# EAGLE design payload-externalPCB-version2-modif2 (EAGLE 6.5.0)
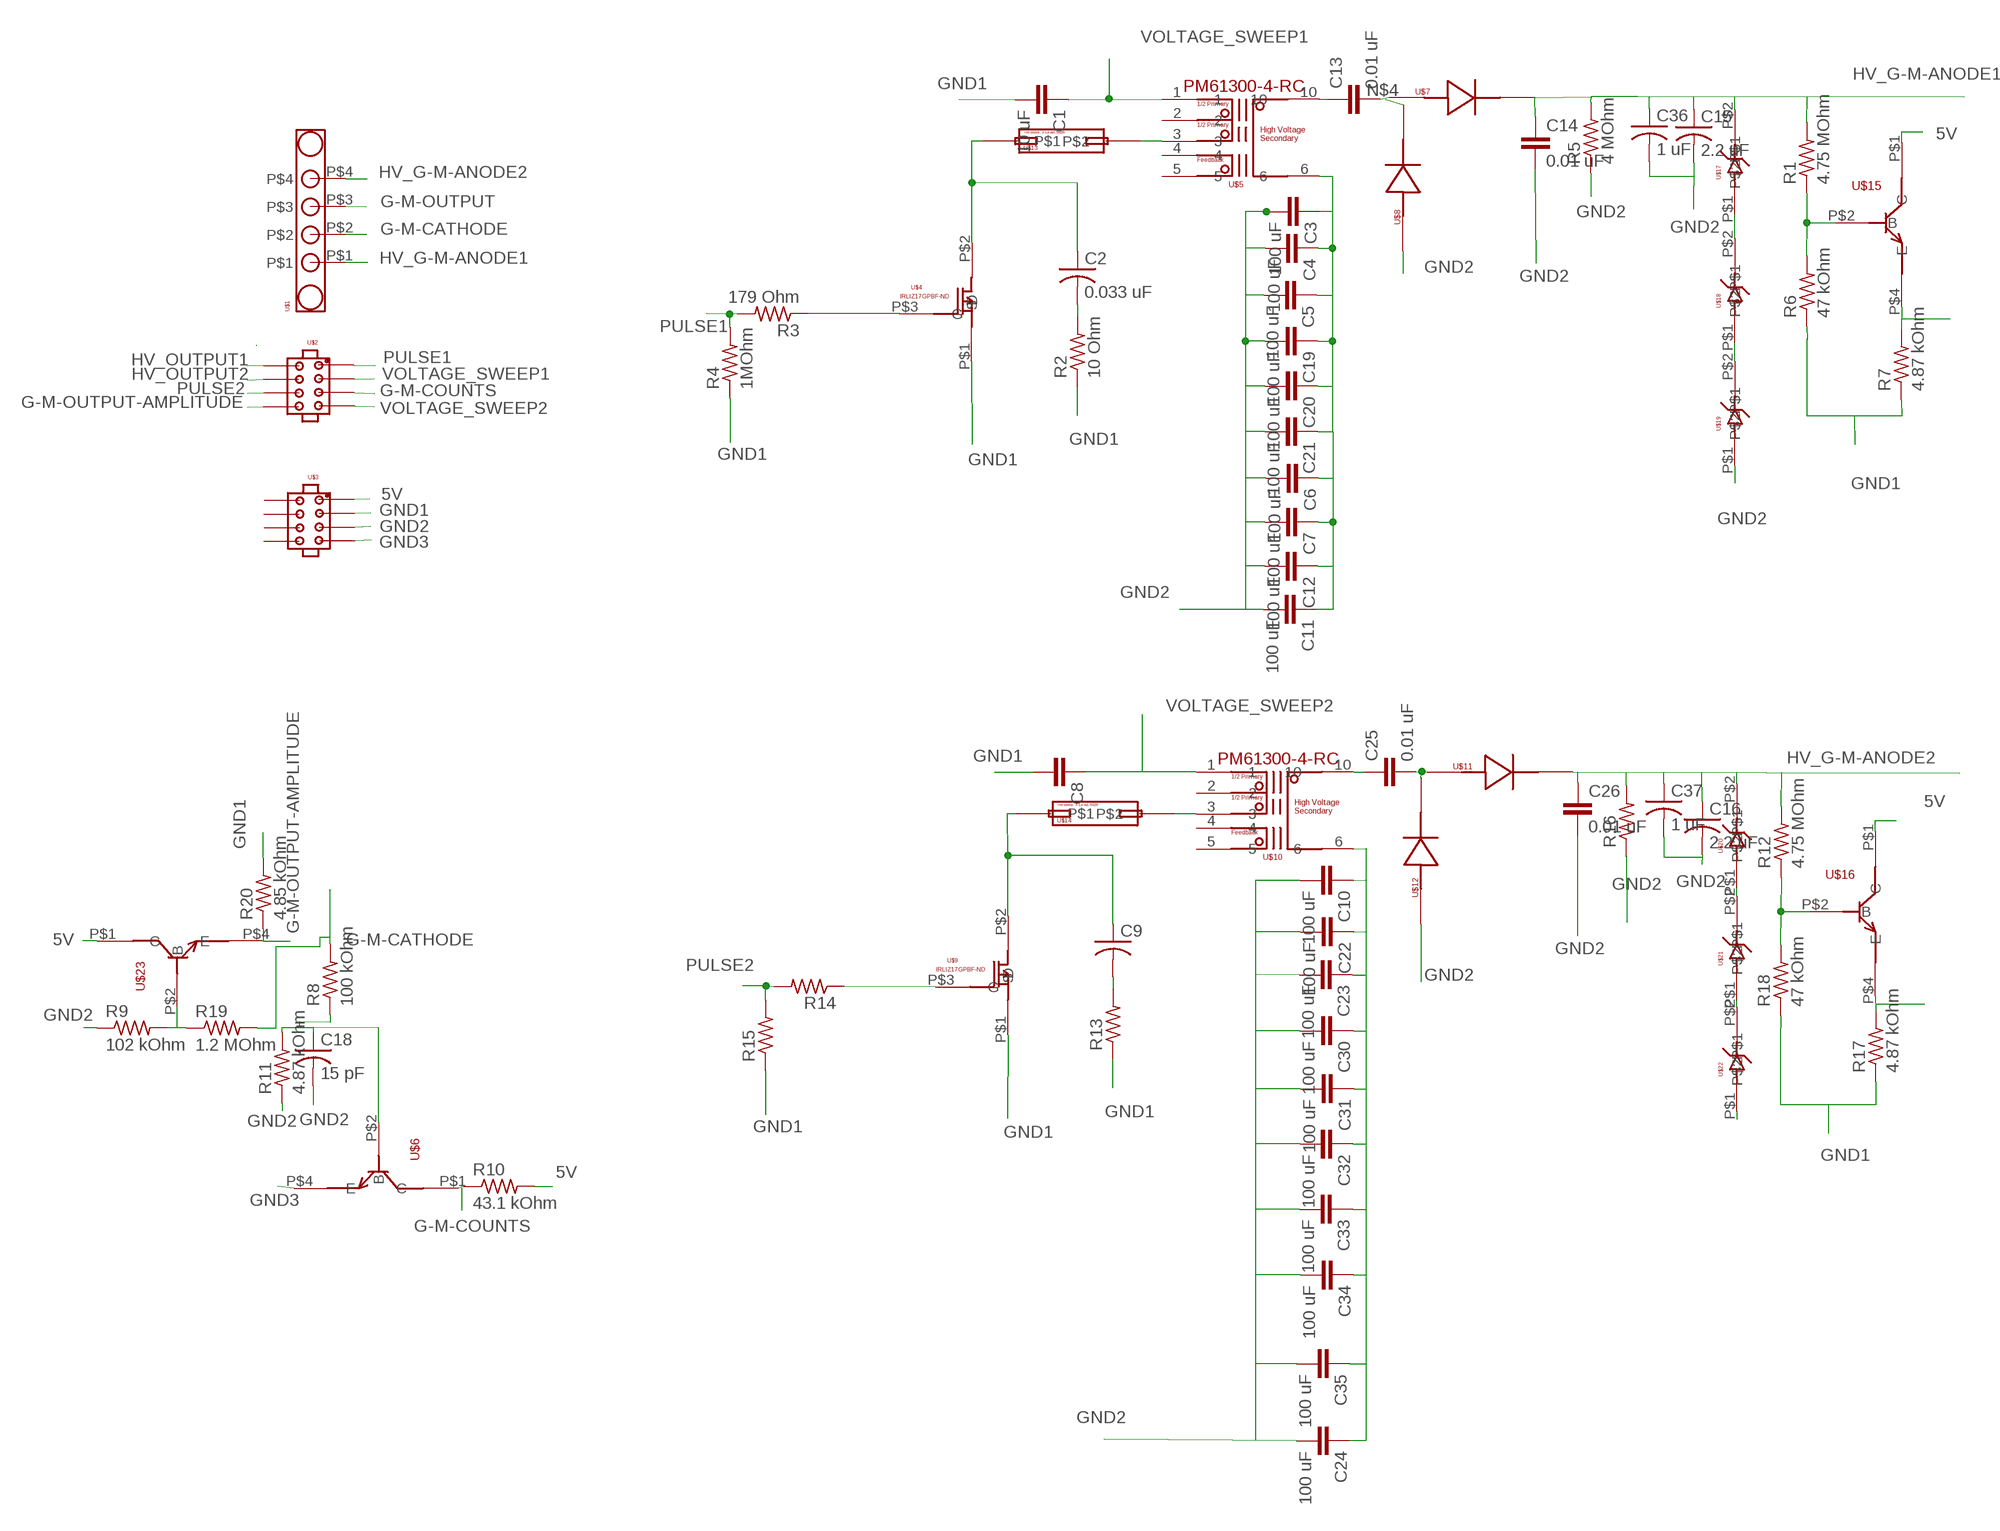
[diagram p0: schematic, sheet 1]

## Parts
C1  10 uF  C-EUC1210  [C1210]
C2  0.033 uF  C-USC0805  [C0805]
C3  100 uF  C-EUC1210  [C1210]
C4  100 uF  C-EUC1210  [C1210]
C5  100 uF  C-EUC1210  [C1210]
C6  100 uF  C-EUC1210  [C1210]
C7  100 uF  C-EUC1210  [C1210]
C8  C-EUC1210  [C1210]
C9  C-USC0805  [C0805]
C10  100 uF  C-EUC1210  [C1210]
C11  100 uF  C-EUC1210  [C1210]
C12  100 uF  C-EUC1210  [C1210]
C13  0.01 uF  C-EUC1206  [C1206]
C14  0.01 uF  C-EUC1206  [C1206]
C15  2.2 uF  C-USC2220K  [C2220K]
C16  2.2 uF  C-USC2220K  [C2220K]
C18  15 pF  C-USC0805  [C0805]
C19  100 uF  C-EUC1210  [C1210]
C20  100 uF  C-EUC1210  [C1210]
C21  100 uF  C-EUC1210  [C1210]
C22  100 uF  C-EUC1210  [C1210]
C23  100 uF  C-EUC1210  [C1210]
C24  100 uF  C-EUC1210  [C1210]
C25  0.01 uF  C-EUC1206  [C1206]
C26  0.01 uF  C-EUC1206  [C1206]
C30  100 uF  C-EUC1210  [C1210]
C31  100 uF  C-EUC1210  [C1210]
C32  100 uF  C-EUC1210  [C1210]
C33  100 uF  C-EUC1210  [C1210]
C34  100 uF  C-EUC1210  [C1210]
C35  100 uF  C-EUC1210  [C1210]
C36  1 uF  C-USC2220K  [C2220K]
C37  1 uF  C-USC2220K  [C2220K]
R1  4.75 MOhm  R-US_R1206  [R1206]
R2  10 Ohm  R-US_R2010  [R2010]
R3  179 Ohm  R-US_R2010  [R2010]
R4  1MOhm  R-US_R2010  [R2010]
R5  4 MOhm  R-US_R2010  [R2010]
R6  47 kOhm  R-US_R1210  [R1210]
R7  4.87 kOhm  R-US_R2010  [R2010]
R8  100 kOhm  R-US_R2010  [R2010]
R9  102 kOhm  R-US_R1206  [R1206]
R10  43.1 kOhm  R-US_R2010  [R2010]
R11  4.87 kOhm  R-US_R1210  [R1210]
R12  4.75 MOhm  R-US_R1206  [R1206]
R13  R-US_R2010  [R2010]
R14  R-US_R2010  [R2010]
R15  R-US_R2010  [R2010]
R16  R-US_R2010  [R2010]
R17  4.87 kOhm  R-US_R2010  [R2010]
R18  47 kOhm  R-US_R1210  [R1210]
R19  1.2 MOhm  R-US_R1206  [R1206]
R20  4.85 kOhm  R-US_R2010  [R2010]
U$1  M80-5000000M2-04-331-00-000  [M80-5000000M2-04-331-00-000]
U$2  M80-8670805  [M80-8670805]
U$3  M80-8670805  [M80-8670805]
U$4  IRLIZ14GPBF-ND-SCHEMATICS  [TO-220FULLPAK-IRLIZ14GPBF-ND]
U$5  PM61300-4-RC  [PM61300-4-RC]
U$6  PZT3904-SOT223-SCHEMATICS  [SOT223-PZT3904]
U$7  S1J-SCHEMATICS  [DO-214AC-S1J]
U$8  S1J-SCHEMATICS  [DO-214AC-S1J]
U$9  IRLIZ14GPBF-ND-SCHEMATICS  [TO-220FULLPAK-IRLIZ14GPBF-ND]
U$10  PM61300-4-RC  [PM61300-4-RC]
U$11  S1J-SCHEMATICS  [DO-214AC-S1J]
U$12  S1J-SCHEMATICS  [DO-214AC-S1J]
U$13  RESISTOR-J-LEAD-5W  [PACKAGE-13573-J-LEAD]
U$14  RESISTOR-J-LEAD-5W  [PACKAGE-13573-J-LEAD]
U$15  PZT3904-SOT223-SCHEMATICS  [SOT223-PZT3904]
U$16  PZT3904-SOT223-SCHEMATICS  [SOT223-PZT3904]
U$17  SMBJ5388B-ZENER-DIODE-200V  [DO-214AA-SMBJ5388B-ZENER]
U$18  SMBJ5388B-ZENER-DIODE-200V  [DO-214AA-SMBJ5388B-ZENER]
U$19  SMBJ5388B-ZENER-DIODE-200V  [DO-214AA-SMBJ5388B-ZENER]
U$20  SMBJ5388B-ZENER-DIODE-200V  [DO-214AA-SMBJ5388B-ZENER]
U$21  SMBJ5388B-ZENER-DIODE-200V  [DO-214AA-SMBJ5388B-ZENER]
U$22  SMBJ5388B-ZENER-DIODE-200V  [DO-214AA-SMBJ5388B-ZENER]
U$23  PZT3904-SOT223-SCHEMATICS  [SOT223-PZT3904]

## Nets
5V: R10.2 U$3.P$1 U$15.P$1(C) U$16.P$1(C) U$23.P$1(C)
G-M-CATHODE: R8.2 R19.2 U$1.P$2
G-M-COUNTS: R10.1 U$2.P$3 U$6.P$1(C)
G-M-OUTPUT: U$1.P$3
G-M-OUTPUT-AMPLITUDE: R20.1 U$2.P$8 U$23.P$4(E)
GND1: C1.2 C8.2 R2.1 R4.1 R6.1 R7.1 R13.1 R15.1 R17.1 R18.1 R20.2 U$3.P$2 U$4.P$1(S) U$9.P$1(S)
GND2: C3.2 C4.2 C5.2 C6.2 C7.2 C10.2 C11.2 C12.2 C14.2 C15.2 C16.2 C18.2 C19.2 C20.2 C21.2 C22.2 C23.2 C24.2 C26.2 C30.2 C31.2 C32.2 C33.2 C34.2 C35.2 C36.2 C37.2 R5.1 R9.1 R11.1 R16.1 U$3.P$3 U$8.P$1(A) U$12.P$1(A) U$19.P$1 U$22.P$1
GND3: U$3.P$4 U$6.P$4(E)
HV_G-M-ANODE1: C14.1 C15.1 C36.1 R1.2 R5.2 U$1.P$1 U$7.P$2(C) U$17.P$2
HV_G-M-ANODE2: C16.1 C26.1 C37.1 R12.2 R16.2 U$1.P$4 U$11.P$2(C) U$20.P$2
HV_OUTPUT1: R7.2 U$2.P$5 U$15.P$4(E)
HV_OUTPUT2: R17.2 U$2.P$6 U$16.P$4(E)
N$1: R3.1 U$4.P$3(G)
N$2: U$17.P$1 U$18.P$2
N$3: C13.1 U$5.10
N$4: C13.2 U$7.P$1(A) U$8.P$2(C)
N$5: R12.1 R18.2 U$16.P$2(B)
N$6: C3.1 C4.1 C5.1 C6.1 C7.1 C11.1 C12.1 C19.1 C20.1 C21.1 U$5.6
N$7: U$5.3 U$13.P$2
N$8: C2.2 R2.2
N$9: C10.1 C22.1 C23.1 C24.1 C30.1 C31.1 C32.1 C33.1 C34.1 C35.1 U$10.6
N$11: C2.1 U$4.P$2(D) U$13.P$1
N$23: R14.1 U$9.P$3(G)
N$24: C9.2 R13.2
N$25: U$10.3 U$14.P$2
N$26: C9.1 U$9.P$2(D) U$14.P$1
N$27: R1.1 R6.2 U$15.P$2(B)
N$28: C25.1 U$10.10
N$41: C25.2 U$11.P$1(A) U$12.P$2(C)
N$42: U$18.P$1 U$19.P$2
N$43: U$20.P$1 U$21.P$2
N$45: U$21.P$1 U$22.P$2
N$46: C18.1 R8.1 R11.2 U$6.P$2(B)
N$47: R9.2 R19.1 U$23.P$2(B)
PULSE1: R3.2 R4.2 U$2.P$1
PULSE2: R14.2 R15.2 U$2.P$7
VOLTAGE_SWEEP1: C1.1 U$2.P$2 U$5.1
VOLTAGE_SWEEP2: C8.1 U$2.P$4 U$10.1
Unconnected: U$3.P$5 U$3.P$6 U$3.P$7 U$3.P$8 U$5.2 U$5.4 U$5.5 U$10.2 U$10.4 U$10.5

## Library data of the parts
C1 C3-C8 C10-C14 C19-C26 C30-C35 = rcl:C-EU: CAPACITOR, European symbol
C2 C9 C15 C16 C18 C36 C37 = rcl:C-US: CAPACITOR, American symbol
R1-R20 = rcl:R-US_: RESISTOR, American symbol
U$1 = Payload-board:M80-5000000M2-04-331-00-000
U$2 U$3 = Payload-board:M80-8670805
U$4 U$9 = Payload-board:IRLIZ14GPBF-ND-SCHEMATICS
U$5 U$10 = Payload-board:PM61300-4-RC
U$6 U$15 U$16 U$23 = Payload-board:PZT3904-SOT223-SCHEMATICS
U$7 U$8 U$11 U$12 = Payload-board:S1J-SCHEMATICS
U$13 U$14 = Payload-board:RESISTOR-J-LEAD-5W
U$17-U$22 = Payload-board:SMBJ5388B-ZENER-DIODE-200V

## Board
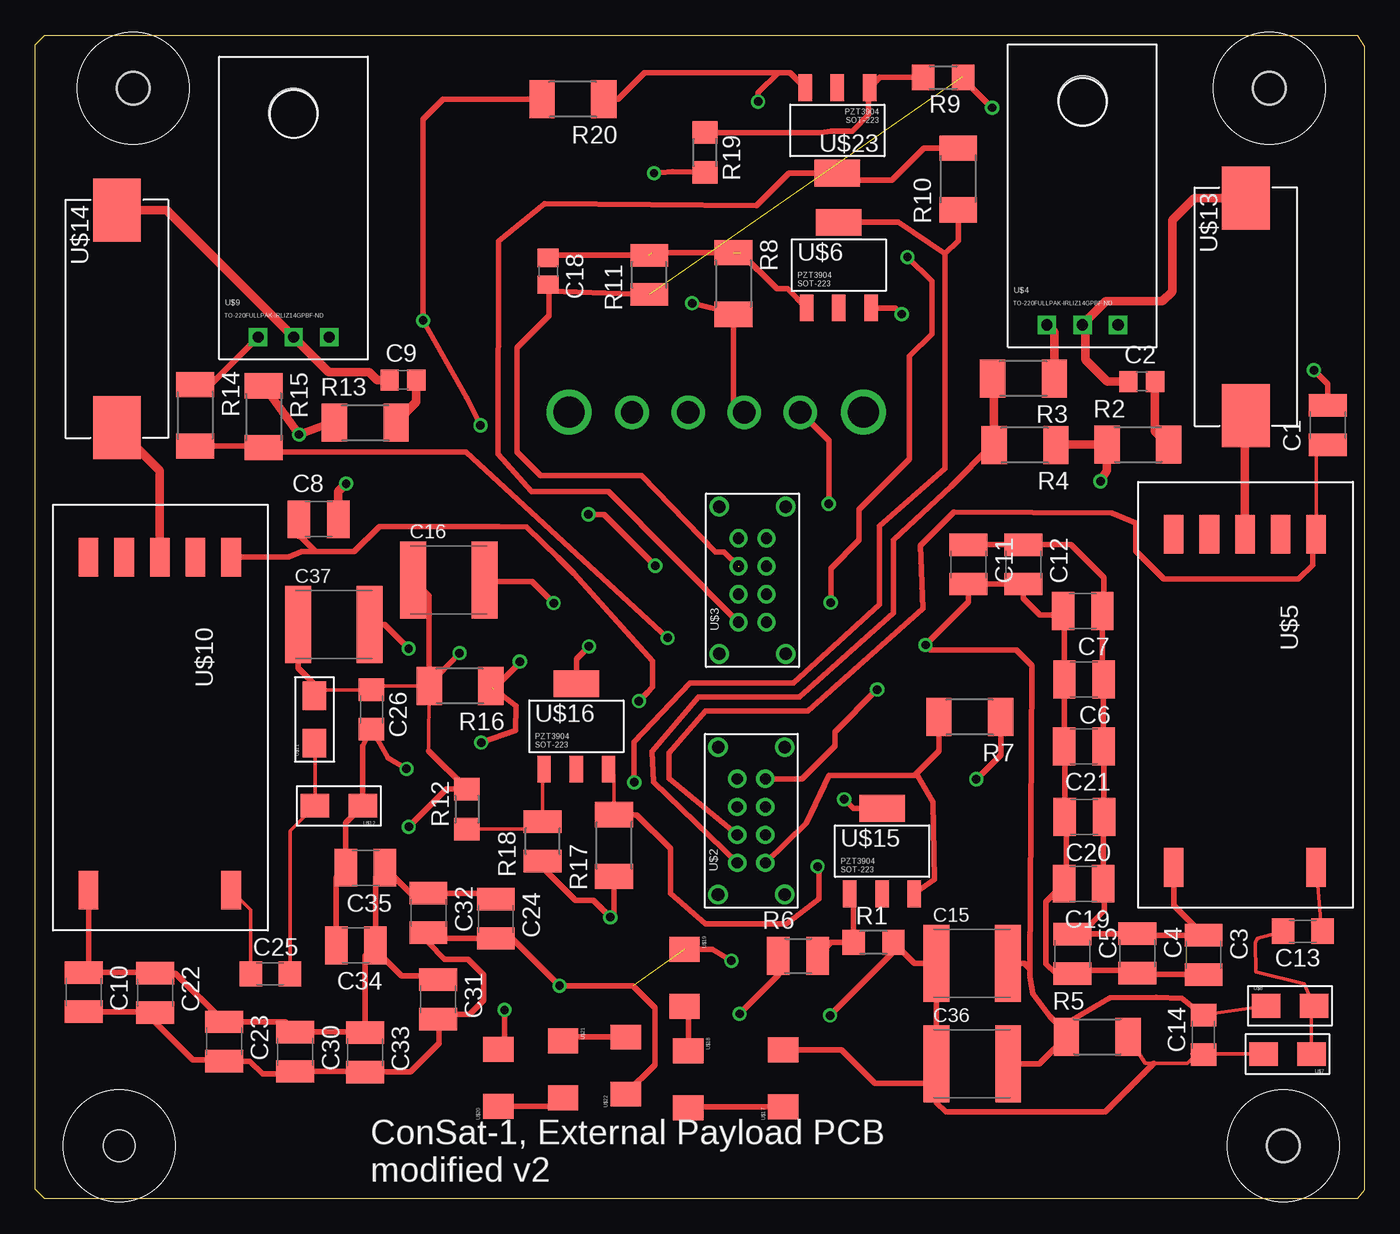
[diagram p1: board, top side]
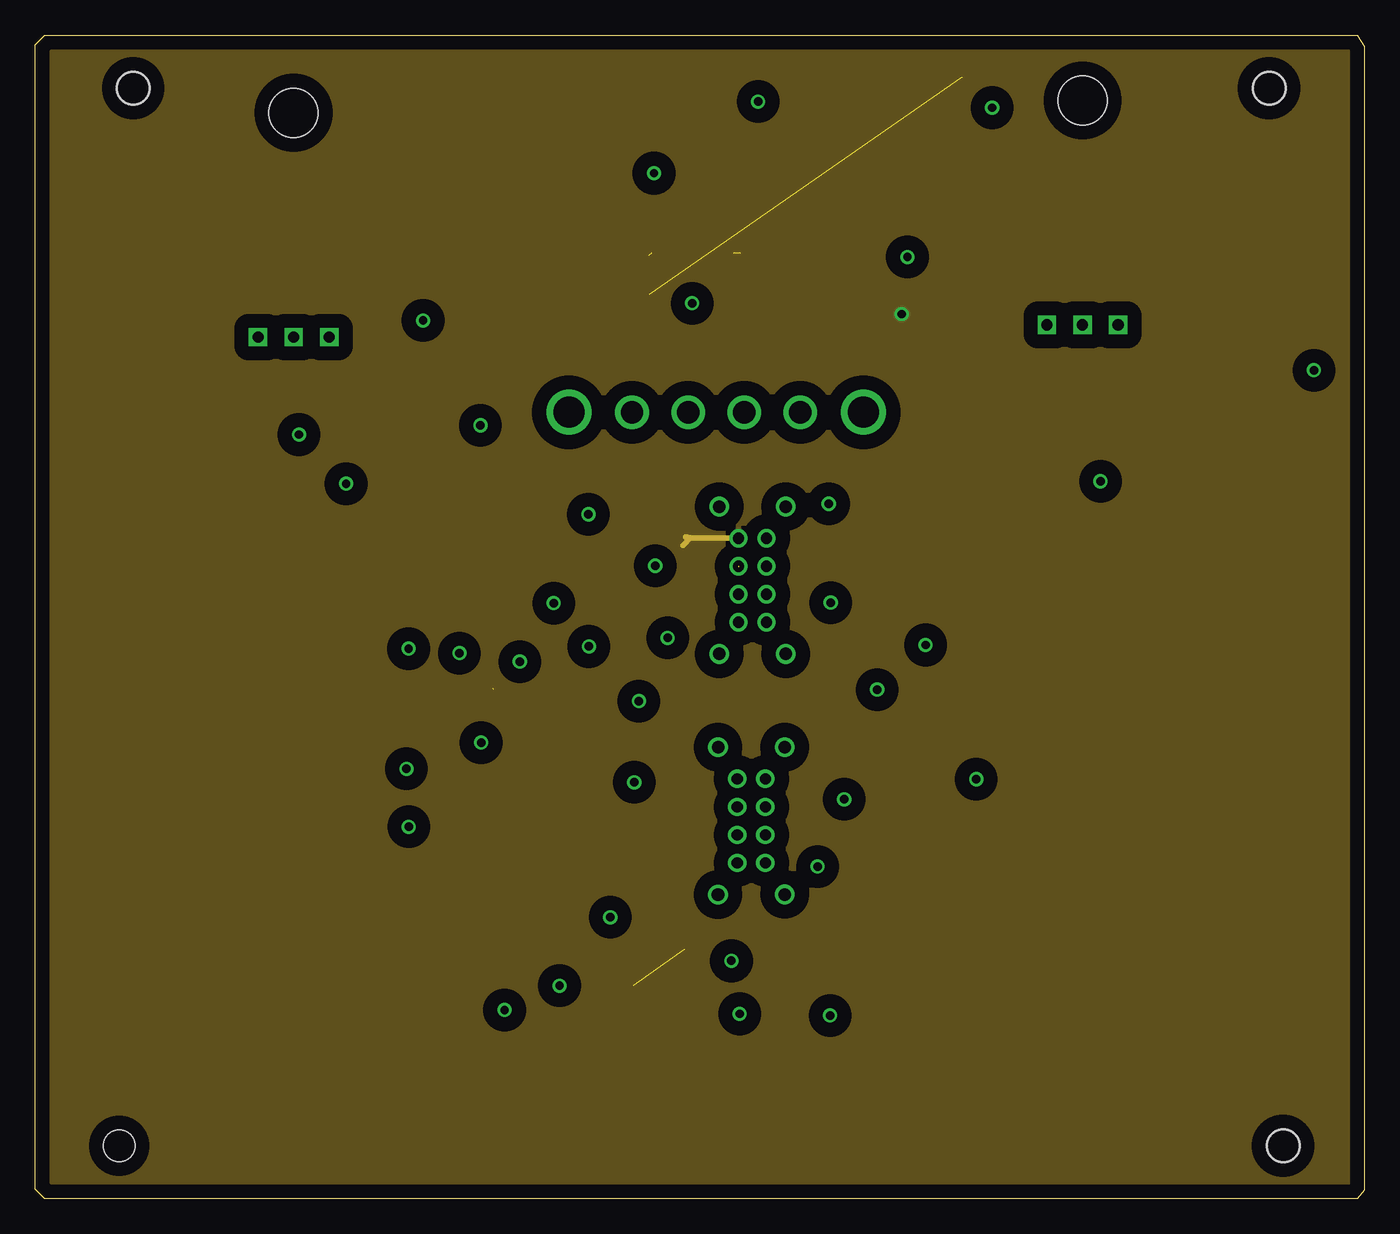
[diagram p2: board, inner layer Layer2]
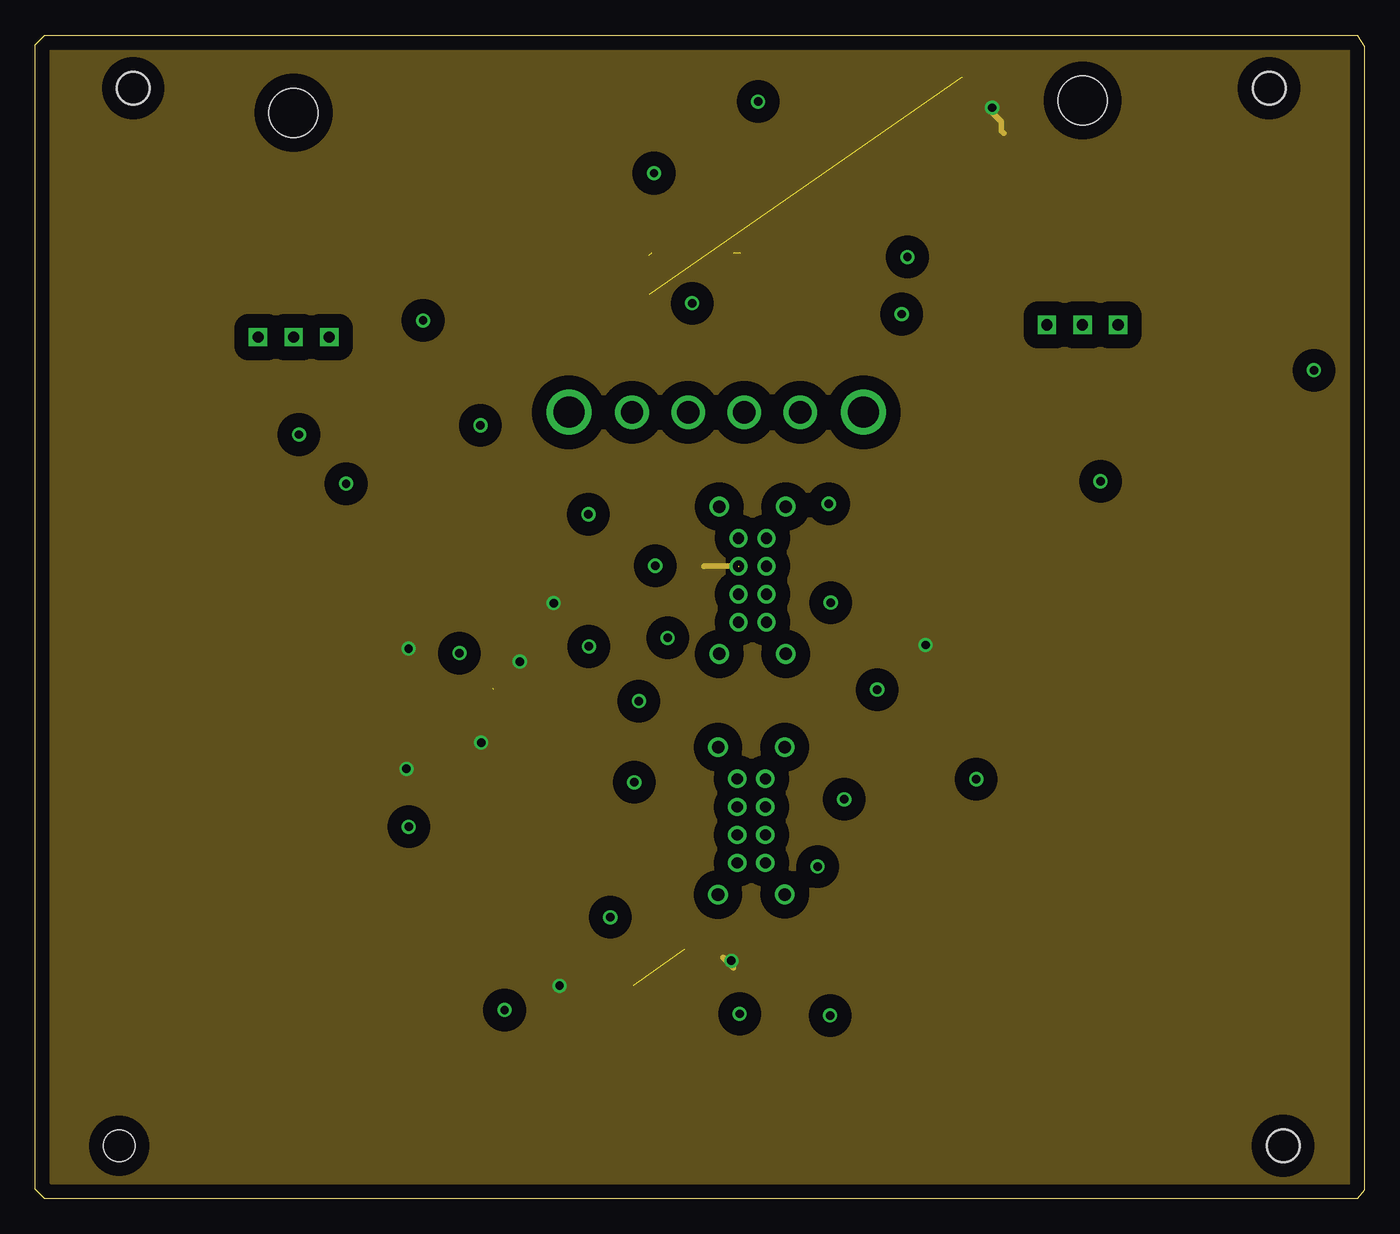
[diagram p3: board, inner layer Layer3]
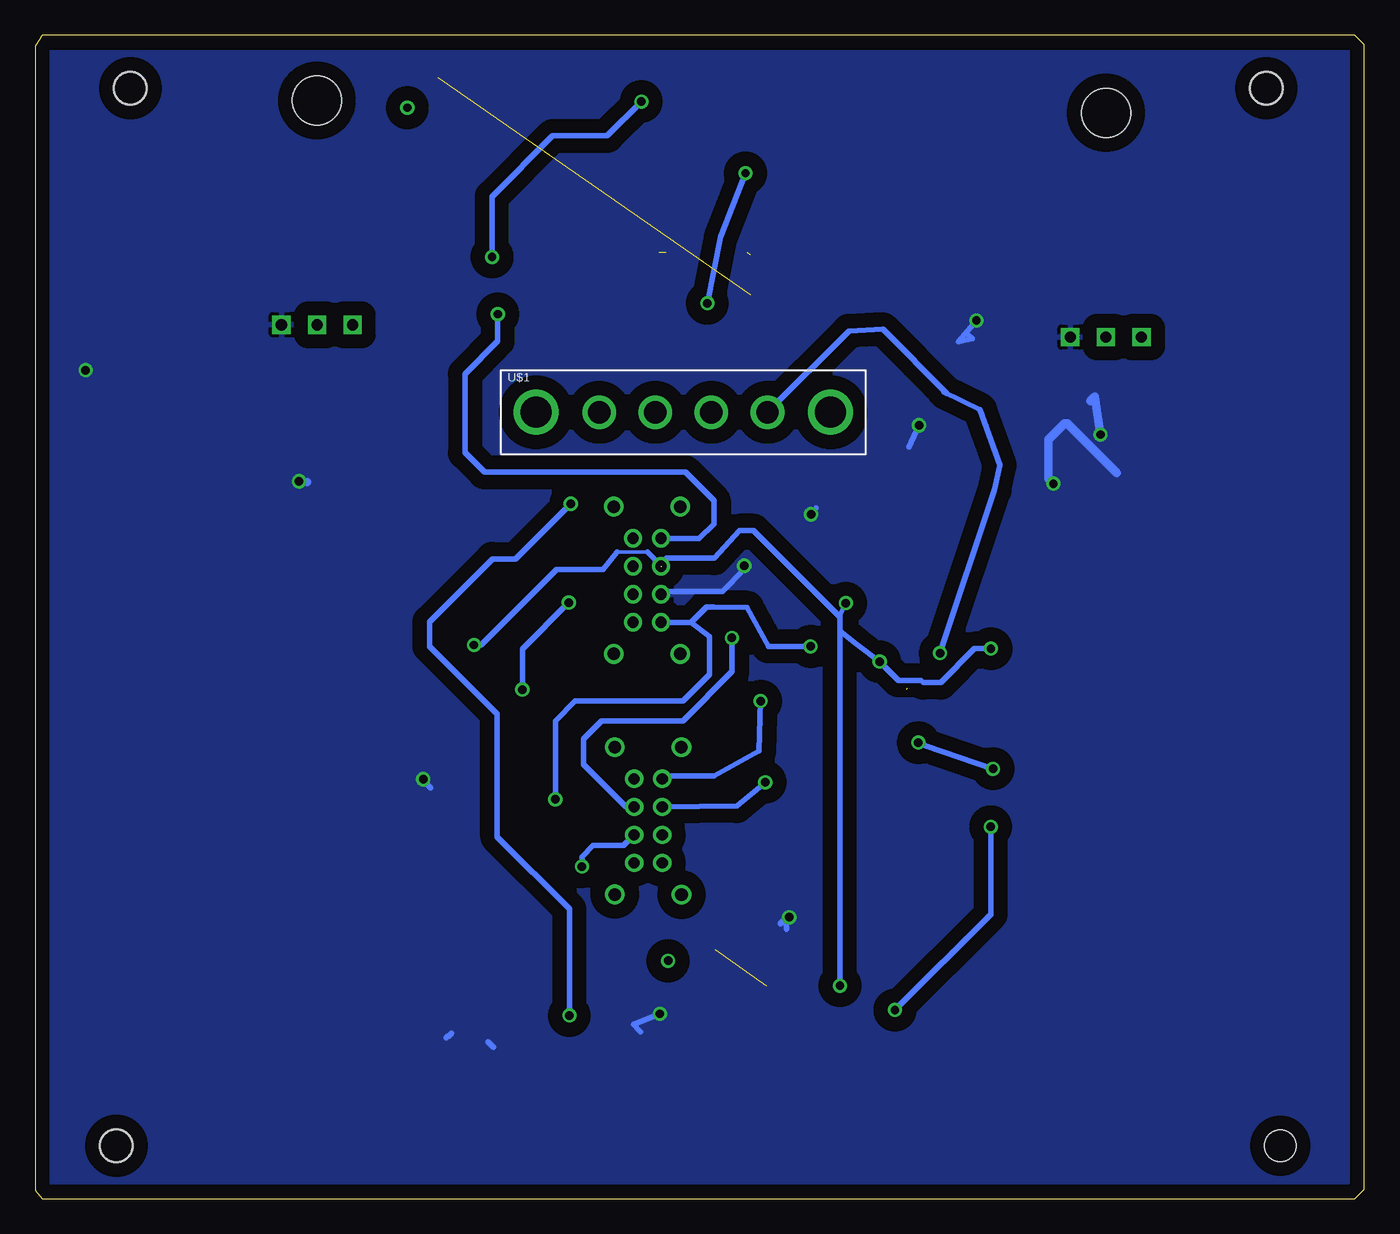
[diagram p4: board, bottom side, seen from below]

Size 94.8 x 83 mm. Coordinates in mm from the lower left corner, seen from the top.
Outline: 94.3,83 94.8,82.2 94.8,0.6 94.3,0 0.7,0 0,0.7 0,82.3 0.7,83 94.3,83
Copper layers (1*2*15*16): Top 0.035mm / dielectric 1.5mm / Layer2 0.035mm / dielectric 0.15mm / Layer3 0.035mm / dielectric 0.2mm / Bottom 0.035mm
Design rules "default *": minimum track width 10mil, minimum drill 24mil, track to track 40mil, track to pad 40mil, pad to pad 10mil, via to via 8mil, smd to smd 8mil, copper to edge 40mil, drill to drill 8mil, minimum pad ring 10mil, minimum via ring 8mil, stop-mask expansion 4mil, vias tented up to drill 0mil, thermal gap 10mil
Holes 2.4 mm at 7,79.2 88,79.2 89,3.8
Holes 2.25 mm at 6,3.8 89,3.8 88,79.2 7,79.2 6,3.8

### Footprints (pad centres in the part's own frame; a part is rotated, then mirrored left to right if it is on the bottom)
C1210 = smd 1.6 x 2.7: 1 -1.4,0; 2 1.4,0
C0805 = smd 1.3 x 1.5: 1 -0.95,0; 2 0.95,0
C1206 = smd 1.6 x 1.8: 1 -1.4,0; 2 1.4,0
C2220K = smd 1.85 x 5.5: 1 -2.55,0; 2 2.55,0
R1206 = smd 1.6 x 1.803: 1 -1.422,0; 2 1.422,0
R2010 = smd 1.8 x 2.7: 1 -2.2,0; 2 2.2,0
R1210 = smd 1.6 x 2.7: 1 -1.4,0; 2 1.4,0
M80-5000000M2-04-331-00-000 = drill 1.6: P$1 -6,0; P$2 -2,0; P$3 2,0; P$4 6,0 | drill 2.2: P$5 -10.5,0; P$6 10.5,0
M80-8670805 = drill 0.8: P$1 -3,1; P$2 -1,1; P$3 1,1; P$4 3,1; P$5 -3,-1; P$6 -1,-1; P$7 1,-1; P$8 3,-1 | drill 0.9: P$9 -5.252,2.378; P$10 -5.25,-2.373; P$11 5.251,-2.376; P$12 5.249,2.374
TO-220FULLPAK-IRLIZ14GPBF-ND = drill 0.8 pad 1.09 square: P$1 2.54,0; P$2 0,0; P$3 -2.54,0 | hole 3.5: 0,16
PM61300-4-RC = smd 2.75 x 1.4: 1 -5,5.08; 2 -5,2.54; 3 -5,0; 4 -5,-2.54; 5 -5,-5.08; 6 18.75,-5.08; 10 18.75,5.08
SOT223-PZT3904 = smd 3.25 x 1.9: P$1 0,3.05 | smd 0.95 x 1.9: P$2 -2.3,-3.05; P$3 0,-3.05; P$4 2.3,-3.05
DO-214AC-S1J = smd 2.032 x 1.68: P$1 -1.7,0; P$2 1.7,0
PACKAGE-13573-J-LEAD = smd 4.5 x 3.4: P$1 -7.75,0; P$2 7.75,0
DO-214AA-SMBJ5388B-ZENER = smd 1.78 x 2.16: P$1 -2.032,0; P$2 2.032,0

### Placement (x,y rotation side)
C1  92.18,55.18 90 top
C2  78.92,58.29 0 top
C3  83.33,17.41 270 top
C4  78.61,17.51 270 top
C5  73.97,17.47 270 top
C6  74.8,37.04 180 top
C7  74.71,41.93 180 top
C8  20.22,48.47 0 top
C9  26.24,58.4 0 top
C10  3.46,14.75 270 top
C11  66.57,45.25 270 top
C12  70.48,45.25 270 top
C13  90.4,19.09 180 top
C14  83.32,11.7 90 top
C15  66.82,16.79 0 top
C16  29.51,44.14 0 top
C18  36.59,66.16 270 top
C19  74.77,22.48 180 top
C20  74.83,27.24 180 top
C21  74.79,32.28 180 top
C22  8.56,14.7 270 top
C23  13.48,11.23 270 top
C24  32.86,19.98 270 top
C25  16.78,16.05 0 top
C26  23.99,34.9 270 top
C30  18.56,10.5 270 top
C31  28.74,14.23 270 top
C32  28.05,20.4 270 top
C33  23.53,10.45 270 top
C34  22.88,18.08 180 top
C35  23.56,23.62 180 top
C36  66.84,9.64 0 top
C37  21.31,40.96 0 top
R1  59.79,18.29 0 top
R2  78.64,53.8 0 top
R3  70.49,58.5 180 top
R4  70.59,53.75 180 top
R5  75.74,11.57 0 top
R6  54.41,17.33 0 top
R7  66.66,34.36 180 top
R8  49.8,65.28 270 top
R9  64.76,79.98 180 top
R10  65.83,72.73 90 top
R11  43.8,65.9 90 top
R12  30.8,27.8 90 top
R13  23.54,55.36 0 top
R14  11.42,55.88 270 top
R15  16.29,55.79 270 top
R16  30.31,36.58 180 top
R17  41.3,25.2 90 top
R18  36.2,25.5 90 top
R19  47.77,74.63 270 top
R20  38.36,78.42 180 top
U$1  48.57,56.1 0 bottom
U$2  51.08,26.96 90 top
U$3  51.16,44.12 90 top
U$4  74.69,62.34 0 top
U$5  86.28,42.39 270 top
U$6  57.32,66.59 0 top
U$7  89.31,10.33 180 top
U$8  89.5,13.77 0 top
U$9  18.44,61.46 0 top
U$10  8.9,40.76 270 top
U$11  19.93,34.19 90 top
U$12  21.66,28.03 180 top
U$13  86.34,63.62 270 top
U$14  5.83,62.76 270 top
U$15  60.4,24.8 0 top
U$16  38.6,33.7 0 top
U$17  53.36,8.61 90 top
U$18  46.59,8.53 270 top
U$19  46.31,15.77 270 top
U$20  33.03,8.63 90 top
U$21  37.65,9.25 270 top
U$22  42.12,9.51 90 top
U$23  57.21,76.2 180 top

### Tracks (layer width: path | path; a pad name or v marks a point on that pad's centre or on a via)
5V  (via drill 0.6)
  Top 0.406: U$15.P$1 58.35,27.85 v57.7,28.5 | U$3.P$1 40.88,50.44 35.41,50.45 33.01,53.11 33.04,68.31 36.32,70.96 51.45,70.82 53.78,73.15 U$23.P$1 57.7,72.66 61.1,72.66 63.37,74.93 R10.2 | U$16.P$1 38.6,38.5 v39.5,39.4
  Layer2 0.406: 49.84,40.8 U$3.P$1
  Bottom 0.406: v57.7,28.5 57.7,34.1 56.3,35.5 48.6,35.5 46.7,37.4 46.7,40.1 48.04,41.11 | 48.04,41.11 49.92,41.11 U$3.P$1 | v39.5,39.4 42.5,39.4 44.02,42.17 46.43,42.22 46.93,42.22 48.04,41.11
G-M-CATHODE  (via drill 0.6)
  Top 0.406: U$1.P$2 49.8,56.87 R8.2 49.72,63.16 v46.86,63.87 | R19.2 45.47,73.25 v44.14,73.15
  Bottom 0.406: v44.14,73.15 45.92,68.57 v46.86,63.87
G-M-COUNTS  (via drill 0.6)
  Top 0.406: 58.07,70.39 U$6.P$1 61.56,69.64 64.9,67.4 | 64.9,67.4 64.9,52.1 60.2,48 60.2,42.4 54.1,36.8 46.7,36.8 42.7,32.6 42.7,29.73 v42.73,29.71 | R10.1 65.83,68.33 64.9,67.4
  Bottom 0.406: v42.73,29.71 44.75,28.02 U$2.P$3
G-M-OUTPUT-AMPLITUDE  (via drill 0.6)
  Top 0.406: R20.1 41.57,78.42 43.47,80.32 53,80.32 | 53,80.32 53.84,80.32 U$23.P$4 | U$2.P$8 54.7,29.96 57.03,32.29 57.03,33.3 v60.05,36.32 | v56.74,42.52 56.74,44.97 58.76,46.99 58.76,49.15 62.36,52.75 62.36,60.11 63.94,61.69 63.94,65.44 v62.21,67.17 | v51.56,78.26 51.56,78.88 53,80.32
  Bottom 0.406: v60.05,36.32 60.05,39.21 v56.74,42.52 | v62.21,67.17 62.21,71.49 57.89,75.81 54.01,75.81 v51.56,78.26
GND1  (via drill 0.6)
  Top 0.254: R17.1 42.48,23.78
  Top 0.406: C1.2 92.18,58.12 v91.2,59.1 | v39.46,48.82 40.56,48.82 v44.23,45.15 | R18.1 36.2,23.65 38.56,21.29 39.82,21.29 v41.02,20.09 41.3,20.37 R17.1 | v31.76,55.17 30.77,57.14 v27.67,62.64 v27.66,62.65 27.66,76.99 29.09,78.42 R20.2 | R7.1 68.86,31.67 v67.12,29.93 | R6.1 53.01,15.97 v50.24,13.2
  Top 0.61: R13.1 21.34,55.42 v18.82,54.51 16.41,57.87 | C8.2 21.62,50.45 v22.18,51.01 | R4.1 72.84,53.8 R2.1 76.44,51.95 v75.98,51.18 | 16.64,57.64 16.41,57.87 | 16.41,57.87 R15.1
  Bottom 0.406: 65.1,11.8 65.3,11.6 65.4,11.6 65.5,11.5 | v91.2,59.1 91.2,59.2 91.3,59.3 | 62.5,11.2 62.1,10.8 | U$3.P$2 49.96,43.32 45.79,43.31 44.23,44.87 v44.23,45.15 | 39.12,49.26 v39.46,48.82 | v41.02,20.09 41.17,20.09 41.65,19.61 | 41.65,19.65 41.21,20.09 41.21,19.23 | v50.24,13.2 52.13,12.44 51.61,11.92 | 32.5,53.61 v31.76,55.17 | v27.67,62.64 28.97,61.14 27.97,61.34 28.27,61.64 | v67.12,29.93 67.12,29.83 66.59,29.3
  Bottom 0.61: v18.82,54.51 19.21,57.2 19.53,56.88 | v22.18,51.01 v22.19,51.01 22.54,51.36 22.54,54.15 21.37,55.32 21.22,55.32 17.65,51.75 | v75.98,51.18 75.76,51.18 75.41,51.14
  pour Bottom: 0.2,1 0.2,82.2 94.3,82.2 94.3,0.9 0.1,0.9
GND2  (via drill 0.6)  (4 unrouted)
  Top 0.254: U$8.P$1 83.8,13.2 C14.2 | R16.1 32.47,37.17 | C26.2 24.55,33.35 24.5,33.3
  Top 0.406: R11.1 36.66,64.74 | 36.66,64.74 C18.2 | 70.94,16.4 70.94,15.84 71.17,14.63 72.35,13.03 73.12,12.27 | 70.94,16.4 71.07,37.59 71.07,38.05 69.98,39.14 63.86,39.14 v63.5,39.5 66.57,42.57 C11.2 C12.2 70.48,42.83 71.67,41.64 73.02,41.64 C7.2 73.4,41.84 C6.2 C21.2 73.43,32.24 C20.2 73.53,27.14 73.53,22.66 73.37,22.5 C19.2 72.08,21.19 72.08,16.77 72.78,16.07 C5.2 74.21,16.31 78.71,16.31 78.61,16.21 C4.2 78.71,16.01 C3.2 | C14.2 81.78,14.3 79.97,14.36 76.66,14.34 73.12,12.27 | 73.12,12.27 73.3,11.81 R5.1 71.61,9.64 C36.2 | 36.66,64.74 36.66,63 34.37,60.72 34.37,53.26 36.04,51.58 43.25,51.58 48.52,46.15 49.13,46.15 U$3.P$3 | v26.49,30.67 25.18,31.46 C26.2 23.36,32.31 U$12.P$1 22.16,26.83 C35.2 21.48,22.94 C34.2 | v31.81,32.54 34.27,33.41 34.29,35.16 32.61,36.44 R16.1 | v34.57,38.32 34.57,38.24 32.65,36.32 | R9.1 66.1,79.98 | 66.1,79.98 66.09,79.99 | 66.1,79.98 66.1,79.97 v68.25,77.82 | C16.2 32.71,44.14 32.82,44.03 | 32.21,42.52 32.21,43.42 32.82,44.03 | C15.2 70.55,16.79 70.94,16.4 | U$19.P$1 48.3,17.8 v49.66,16.98 | U$22.P$1 44.21,9.57 44.21,13.64 42.65,15.2 v37.4,15.2 34.02,18.58 C24.2 28.47,18.58 C32.2 28.05,18.25 29.22,17.08 30.88,17.08 31.97,15.99 31.97,14.16 30.97,13.16 29.07,13.16 C31.2 28.8,12.94 28.8,11.08 26.77,9.05 C33.2 23.48,9.1 C30.2 18.75,8.91 | 32.82,44.03 35.44,44.03 v36.98,42.49 | C37.2 24.92,40.96 v26.64,39.24 | C10.2 8.51,13.35 C22.2 8.56,12.58 11.23,9.91 13.4,9.91 C23.2 15.31,9.83 16.23,8.91 18.75,8.91 | 19.06,8.91 18.75,8.91
  Layer3 0.406: U$3.P$3 47.7,45.12 47.7,45.1 | v68.25,77.82 68.25,77.49 68.92,76.82 68.92,76.15 69.08,75.99 | v49.66,16.98 49.07,17.22 49.8,16.49
  Bottom 0.254: 53.29,46.12 51.13,46.12
  Bottom 0.406: v63.5,39.5 63,39.5 57.6,44.9 54.3,44.9 53.29,46.12 | 51.13,46.12 U$3.P$3 49.86,44.82 | v26.49,30.67 31.27,32.32 v31.81,32.54 | v37.4,15.2 37.4,40.51 | 37.4,40.51 37.4,41.49 | 37.4,41.49 43.56,47.65 44.56,47.65 46.35,45.7 49.77,45.7 50.18,45.05 50.22,45.07 | v36.98,42.49 37.4,41.65 37.4,41.49 | 37.4,40.51 36.2,39.53 v34.57,38.32 33.24,36.99 31.63,36.99 31.46,36.82 30.22,36.82 27.8,39.24 v26.64,39.24
  pour Layer3: 0,0.9 0,82.1 94.5,82.1 94.5,0.9
GND3  (via drill 0.6)
  Top 0.406: 59.96,63.54 U$6.P$4 61.36,63.54 v61.8,63.1
  Layer2 0.406: 46.2,46.6 46.72,47.12 46.98,47.12 46.48,47.19 | 46.48,47.19 46.4,47.2 | U$3.P$4 46.48,47.12 46.48,47.19
  Bottom 0.406: v61.8,63.1 61.8,61.18 64.15,58.83 64.15,53.22 62.76,51.83 48.43,51.83 46.4,49.8 46.4,48.13 47.44,47.09 50.13,47.09 U$3.P$4
  pour Layer2: -0.1,1 -0.1,83.3 94.1,83.3 94.1,0.9 -0.1,0.9
HV_G-M-ANODE1  (via drill 0.6)
  Top 0.254: U$7.P$2 82.82,10.33 | 82.82,10.33 82.48,10.33 C14.1 | R5.2 79.19,9.67 79.78,9.67 82.16,9.67 82.82,10.33
  Top 0.406: v56.6,49.57 56.6,54.07 U$1.P$1 | 64.29,9.02 C36.1 64.29,16.77 C15.1 62.71,16.79 R1.2 61.21,17.6 v56.69,13.08 | 64.29,9.02 64.29,6.86 64.94,6.21 76.32,6.21 79.78,9.67 | U$17.P$2 57.5,10.64 59.89,8.25 63.52,8.25 64.29,9.02
  Bottom 0.406: v56.69,13.08 56.69,20.67 61.85,25.83 61.85,34.57 66.68,39.4 66.68,41.15 62.18,45.65 60.52,45.65 v56.6,49.57
HV_G-M-ANODE2  (via drill 0.6)
  Top 0.254: 20.1,35.6 19.93,35.77 U$11.P$2 20.34,36.3 C26.1 24.83,36.58 R16.2 28.07,31.95
  Top 0.406: 28.07,31.95 R12.2 29.33,29.22 v26.65,26.54 | v30.26,38.92 28.02,36.58 R16.2 28.11,42.99 C16.1 | 18.73,41.93 C37.1 18.76,37.88 20.34,36.3 | U$20.P$2 33.48,11.11 v33.48,13.47
  Bottom 0.406: v30.26,38.92 26.38,50.54 26,52.32 27.41,56.29 29.98,57.54 29.77,57.44 34.35,62.02 36.77,61.9 U$1.P$4 | v33.48,13.47 26.65,20.3 v26.65,26.54
HV_OUTPUT1
  Top 0.406: 63,21.45 U$15.P$4 62.82,21.86 64.15,22.77 64.03,28.31 62.91,30.2 62.71,30.2 | 62.71,30.2 56.62,30.2 55.02,26.8 U$2.P$5 | R7.2 64.46,31.95 62.71,30.2
HV_OUTPUT2  (via drill 0.6)
  Top 0.254: R17.2 41.3,30.25 U$16.P$4
  Top 0.406: R17.2 42.9,27.4 45.3,25 45.3,21.8 47.8,19.6 53.6,19.6 55.9,21.4 55.9,23.6 v55.8,23.7
  Bottom 0.406: v55.8,23.7 55.8,24.4 55,25.2 52.84,25.2 U$2.P$6
N$1
  Top 0.61: R3.1 72.69,61.8 U$4.P$3
N$2
  Top 0.406: U$17.P$1 46.67,6.58 U$18.P$2
N$3
  Top 0.254: U$5.10 91.73,19.39 C13.1
N$4
  Top 0.254: C13.2 87.15,18.59 87.03,18.26 87.05,16.21 90.5,15.33 U$8.P$2 91.01,14.04 U$7.P$1
N$5
  Top 0.254: R12.1 35.68,26.38 R18.2 36.2,30.55 U$16.P$2
N$6
  Top 0.406: C11.1 C12.1 73.88,46.65 76.21,44.32 76.21,42.03 C7.1 76.11,37.13 C6.1 C21.1 76.23,32.24 C20.1 76.17,27.18 C19.1 76.27,22.38 76.27,20.56 74.64,18.93 | C5.1 74.58,18.87 74.64,18.93 | 74.64,18.93 74.66,18.91 C4.1 78.71,18.81 C3.1 81.2,20.94 U$5.6
N$7
  Top 0.61: U$5.3 86.28,55.81 U$13.P$2
N$8
  Top 0.61: C2.2 79.87,54.77 R2.2
N$9
  Top 0.406: U$10.6 3.82,16.51 C10.1 8.51,16.15 C22.1 10.01,16.1 C23.1 17.83,12.63 C30.1 23.48,11.9 C33.1 23.53,17.33 C34.1 | C34.1 24.28,17.77 26.14,15.91 28.46,15.91 C31.1 | C34.1 24.28,22.94 C35.1 26.78,21.8 C32.1 32.44,21.8 C24.1
N$11
  Top 0.61: U$13.P$1 82.67,71.37 81.1,69.8 81.1,64.7 80.4,64.02 76.35,64.02 U$4.P$2 74.91,62.12 74.91,59.86 76.48,58.29 C2.1
N$23
  Top 0.406: R14.1 12.52,58.08 U$9.P$3
N$24
  Top 0.61: C9.2 27.19,56.81 R13.2
N$25
  Top 0.61: U$10.3 8.9,51.94 U$14.P$2
N$26
  Top 0.61: U$14.P$1 9.39,70.51 U$9.P$2 | 18.3,61.32 U$9.P$2 | C9.1 24.38,58.4 23.81,58.97 20.93,58.97 U$9.P$2
N$27
  Top 0.406: 58.4,21.45 U$15.P$2 58.37,21.48 R1.1 56.77,18.29 R6.2
N$28
  Top 0.254: C25.1 15.38,20.61 U$10.10
N$41
  Top 0.254: C25.2 18.18,26.25 U$12.P$2 19.96,32.46 U$11.P$1
N$42
  Top 0.406: U$18.P$1 46.59,13.46 U$19.P$2
N$43
  Top 0.406: 33.76,7.22 U$20.P$1 37.03,6.6 U$21.P$2
N$45
  Top 0.406: U$21.P$1 37.91,11.54 U$22.P$2
N$46  (2 unrouted)
  Top 0.406: R11.2 36.78,67.3 C18.1 | R8.1 43.98,67.48 | 50.32,67.48 52.9,64.9 53.66,64.9 U$6.P$2
N$47
  Top 0.406: R9.2 60.24,79.98 U$23.P$2 59.44,79.18 59.44,77.32 58.28,76.16 56.77,76.16 56.01,76.05 R19.1
PULSE1
  Top 0.406: U$2.P$1 44.1,29.74 44,31.9 47.3,35.8 54.5,35.8 61.2,41.8 61.2,47 65.3,50.8 68.25,53.75 R4.2
  Top 0.61: R4.2 68.39,58.4 R3.2
PULSE2  (via drill 0.6)
  Top 0.406: v45.11,40.01 30.73,53.25 16.63,53.25 R15.2 16.2,53.68 R14.2
  Bottom 0.406: v45.11,40.01 45.1,37.6 48.6,34.1 54.4,34.1 55.7,32.8 55.7,31 52.7,28 52.12,28 U$2.P$7
VOLTAGE_SWEEP1
  Top 0.254: U$5.1 91.36,52.96 C1.1
  Top 0.406: U$2.P$2 45.22,29.98 45.2,31.8 47.8,34.8 55.1,34.8 63.3,42.1 63.12,46.58 65.52,48.98 76.79,48.92 78.5,48.2 78.5,46.2 80.5,44.2 90.1,44.2 91.1,45.2 91.1,47.13 U$5.1
VOLTAGE_SWEEP2  (via drill 0.6)
  Top 0.406: U$10.1 18.08,45.76 19.02,46.16 20.02,46.16 | v43.06,35.5 43.69,36.13 44.03,36.51 44.03,38.35 38.42,44.6 37.29,45.74 35.04,47.93 33.1,47.94 33.08,47.96 24.57,47.96 22.77,46.16 20.02,46.16 | 18.82,47.35 20.02,46.16
  Top 0.61: C8.1 18.82,47.35
  Bottom 0.406: v43.06,35.5 43.16,31.94 46.39,30.16 49.88,30.16 U$2.P$4

### Text on the board
tPlace: ConSat-1, External Payload PCB / modified v2